# EAGLE design delay_line (EAGLE 9.2.2)
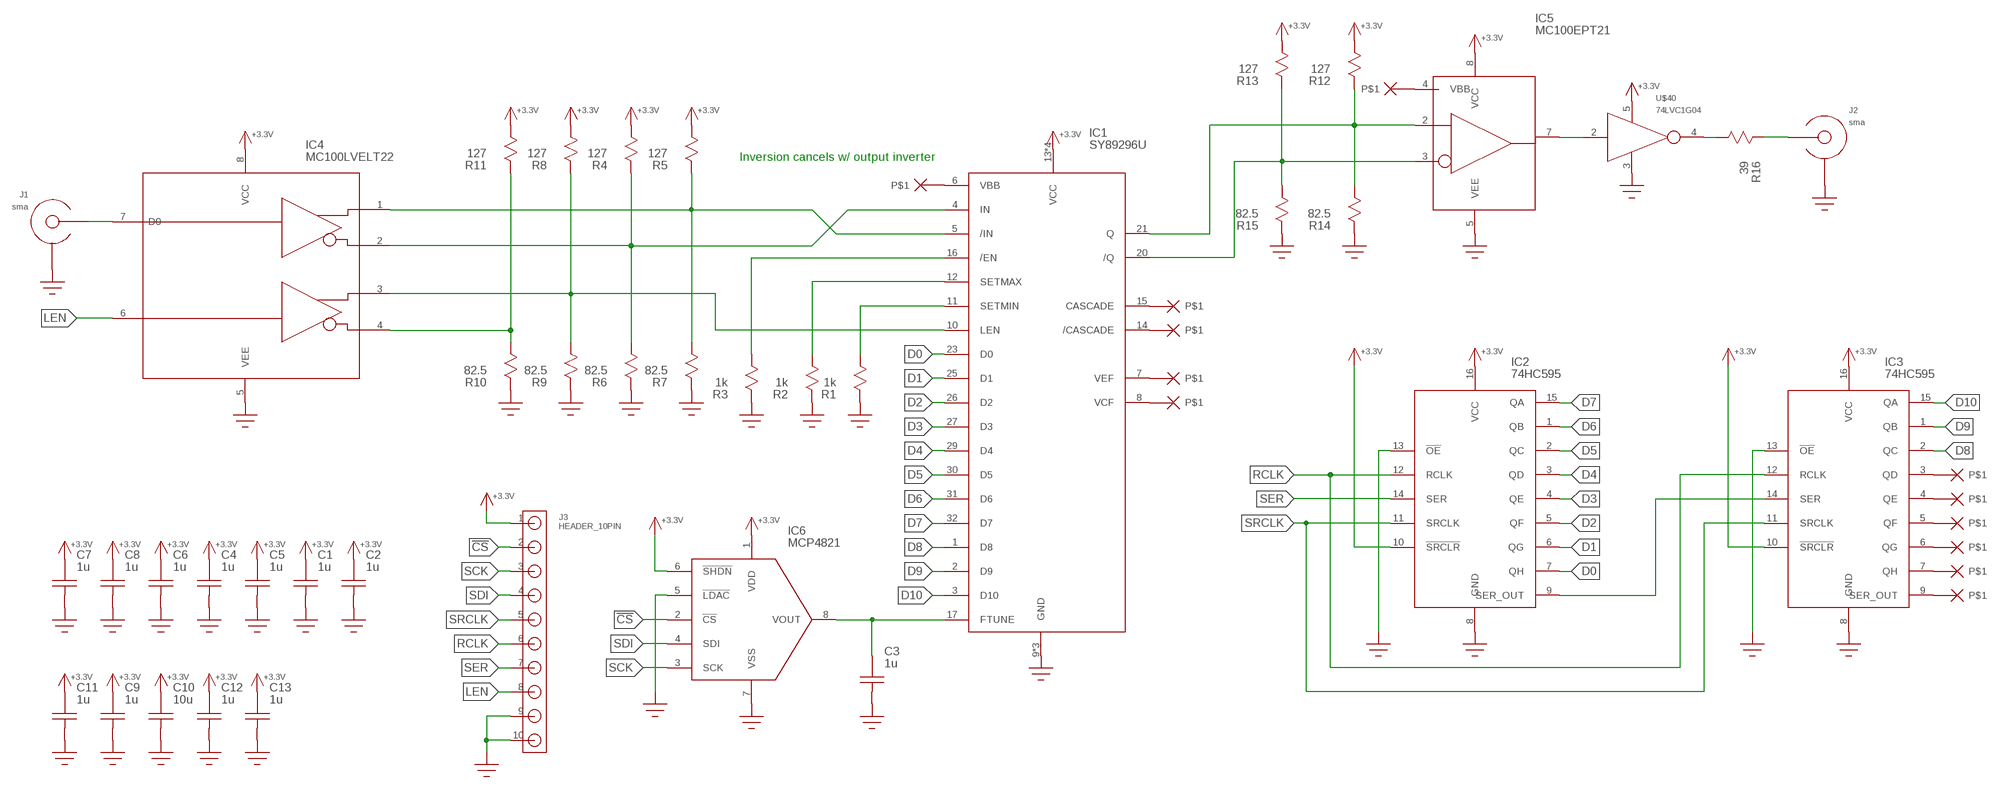
[diagram p0: schematic, sheet 1]

## Parts
C1  1u  C0603  [C0603]
C2  1u  C0603  [C0603]
C3  1u  C0603  [C0603]
C4  1u  C0603  [C0603]
C5  1u  C0603  [C0603]
C6  1u  C0603  [C0603]
C7  1u  C0603  [C0603]
C8  1u  C0603  [C0603]
C9  1u  C0805  [0805]
C10  10u  C1206  [1206]
C11  1u  C0805  [0805]
C12  1u  C0603  [C0603]
C13  1u  C0805  [0805]
IC1  SY89296U  [TQFP32_7X7]
IC2  74HC595  74XX595  [SOIC-16]
IC3  74HC595  74XX595  [SOIC-16]
IC4  MC100LVELT22  [SOIC8]
IC5  MC100EPT21  [SOIC8]
IC6  MCP4821  MCP48X1  [SOIC8]
J1  sma  EDGE_LAUNCH_JACK  [EDGE_LAUNCH_RF_CON]
J2  sma  EDGE_LAUNCH_JACK  [EDGE_LAUNCH_RF_CON]
J3  HEADER_10PIN  [HEADER_10PIN]
R1  1k  R0603  [R0603]
R2  1k  R0603  [R0603]
R3  1k  R0603  [R0603]
R4  127  R0603  [R0603]
R5  127  R0603  [R0603]
R6  82.5  R0603  [R0603]
R7  82.5  R0603  [R0603]
R8  127  R0603  [R0603]
R9  82.5  R0603  [R0603]
R10  82.5  R0603  [R0603]
R11  127  R0603  [R0603]
R12  127  R0603  [R0603]
R13  127  R0603  [R0603]
R14  82.5  R0603  [R0603]
R15  82.5  R0603  [R0603]
R16  39  R0603  [R0603]
U$15  NO_CONNECT  (no package)
U$16  NO_CONNECT  (no package)
U$17  NO_CONNECT  (no package)
U$18  NO_CONNECT  (no package)
U$19  NO_CONNECT  (no package)
U$20  NO_CONNECT  (no package)
U$21  NO_CONNECT  (no package)
U$22  NO_CONNECT  (no package)
U$23  NO_CONNECT  (no package)
U$24  NO_CONNECT  (no package)
U$25  NO_CONNECT  (no package)
U$40  74LVC1G04  [SOT23-5]
U$71  NO_CONNECT  (no package)

## Nets
!CS!: IC6.2(!CS!) J3.2
+3.3V: C1.P$2 C2.P$2 C4.P$2 C5.P$2 C6.P$2 C7.P$2 C8.P$2 C9.P$2 C10.P$2 C11.P$2 C12.P$2 C13.P$2 IC1.13(VCC) IC1.18(VCC) IC1.19(VCC) IC1.22(VCC) IC2.10(!SRCLR!) IC2.16(VCC) IC3.10(!SRCLR!) IC3.16(VCC) IC4.8(VCC) IC5.8(VCC) IC6.1(VDD) IC6.6(!SHDN!) J3.1 R4.P$2 R5.P$2 R8.P$2 R11.P$2 R12.P$2 R13.P$2 U$40.5(VCC)
D0: IC1.23(D0) IC2.7(QH)
D1: IC1.25(D1) IC2.6(QG)
D2: IC1.26(D2) IC2.5(QF)
D3: IC1.27(D3) IC2.4(QE)
D4: IC1.29(D4) IC2.3(QD)
D5: IC1.30(D5) IC2.2(QC)
D6: IC1.31(D6) IC2.1(QB)
D7: IC1.32(D7) IC2.15(QA)
D8: IC1.1(D8) IC3.2(QC)
D9: IC1.2(D9) IC3.1(QB)
D10: IC1.3(D10) IC3.15(QA)
GND: C1.P$1 C2.P$1 C3.P$1 C4.P$1 C5.P$1 C6.P$1 C7.P$1 C8.P$1 C9.P$1 C10.P$1 C11.P$1 C12.P$1 C13.P$1 IC1.9(GND) IC1.24(GND) IC1.28(GND) IC2.8(GND) IC2.13(!OE!) IC3.8(GND) IC3.13(!OE!) IC4.5(VEE) IC5.5(VEE) IC6.5(!LDAC!) IC6.7(VSS) J1.GND@1(SHIELD) J1.GND@2(SHIELD) J1.GND@3(SHIELD) J1.GND@4(SHIELD) J1.GND@5(SHIELD) J1.GND@6(SHIELD) J1.GND@7(SHIELD) J1.GND@8(SHIELD) J1.GND@9(SHIELD) J1.GND@10(SHIELD) J1.GND@11(SHIELD) J1.GND@12(SHIELD) J1.SHIELD@1(SHIELD) J1.SHIELD@2(SHIELD) J2.GND@1(SHIELD) J2.GND@2(SHIELD) J2.GND@3(SHIELD) J2.GND@4(SHIELD) J2.GND@5(SHIELD) J2.GND@6(SHIELD) J2.GND@7(SHIELD) J2.GND@8(SHIELD) J2.GND@9(SHIELD) J2.GND@10(SHIELD) J2.GND@11(SHIELD) J2.GND@12(SHIELD) J2.SHIELD@1(SHIELD) J2.SHIELD@2(SHIELD) J3.9 J3.10 R1.P$1 R2.P$1 R3.P$1 R6.P$1 R7.P$1 R9.P$1 R10.P$1 R14.P$1 R15.P$1 U$40.3(GND)
IN_N [50_ohm]: IC1.5(/IN) IC4.1(Q0) R5.P$1 R7.P$2
IN_P [50_ohm]: IC1.4(IN) IC4.2(!Q0!) R4.P$1 R6.P$2
LEN: IC4.6(D1) J3.8
N$1: IC2.9(SER_OUT) IC3.14(SER)
N$2: IC1.7(VEF) U$15.P$1
N$3: IC3.3(QD) U$16.P$1
N$4: IC3.4(QE) U$17.P$1
N$5: IC3.5(QF) U$18.P$1
N$6: IC3.6(QG) U$19.P$1
N$7: IC3.7(QH) U$20.P$1
N$8: IC3.9(SER_OUT) U$21.P$1
N$9: IC1.6(VBB) U$22.P$1
N$10: IC1.8(VCF) U$23.P$1
N$11: IC1.15(CASCADE) U$24.P$1
N$12: IC1.14(/CASCADE) U$25.P$1
N$13: IC1.11(SETMIN) R1.P$2
N$14: IC1.12(SETMAX) R2.P$2
N$15: IC1.16(/EN) R3.P$2
N$18: IC1.10(LEN) IC4.3(Q1) R8.P$1 R9.P$2
N$19: IC4.4(!Q1!) R10.P$2 R11.P$1
N$20: IC5.7(Q) U$40.2(IN)
N$21: IC4.7(D0) J1.CENTER
N$24: R16.P$2 U$40.4(OUT)
N$25: J2.CENTER R16.P$1
N$26: C3.P$2 IC1.17(FTUNE) IC6.8(VOUT)
N$37: IC5.4(VBB) U$71.P$1
Q_N [50_ohm]: IC1.20(/Q) IC5.3(!D!) R13.P$1 R15.P$2
Q_P [50_ohm]: IC1.21(Q) IC5.2(D) R12.P$1 R14.P$2
RCLK: IC2.12(RCLK) IC3.12(RCLK) J3.6
SCK: IC6.3(SCK) J3.3
SDI: IC6.4(SDI) J3.4
SER: IC2.14(SER) J3.7
SRCLK: IC2.11(SRCLK) IC3.11(SRCLK) J3.5

## Notes on the sheet
- Inversion cancels w/ output inverter

## Library data of the parts
C1-C13 = yapo:C
IC1 = yapo:SY89296U
IC2 IC3 = yapo:74XX595
IC4 = yapo:MC100LVELT22
IC5 = yapo:MC100EPT21
IC6 = yapo:MCP48X1
J1 J2 = yapo:EDGE_LAUNCH_JACK
J3 = yapo:HEADER_10PIN
R1-R16 = yapo:R
U$15-U$25 U$71 = yapo:NO_CONNECT
U$40 = yapo:74LVC1G04

## Net classes
1 50_ohm: width 0.345 mm, clearance 0.244 mm

## Board
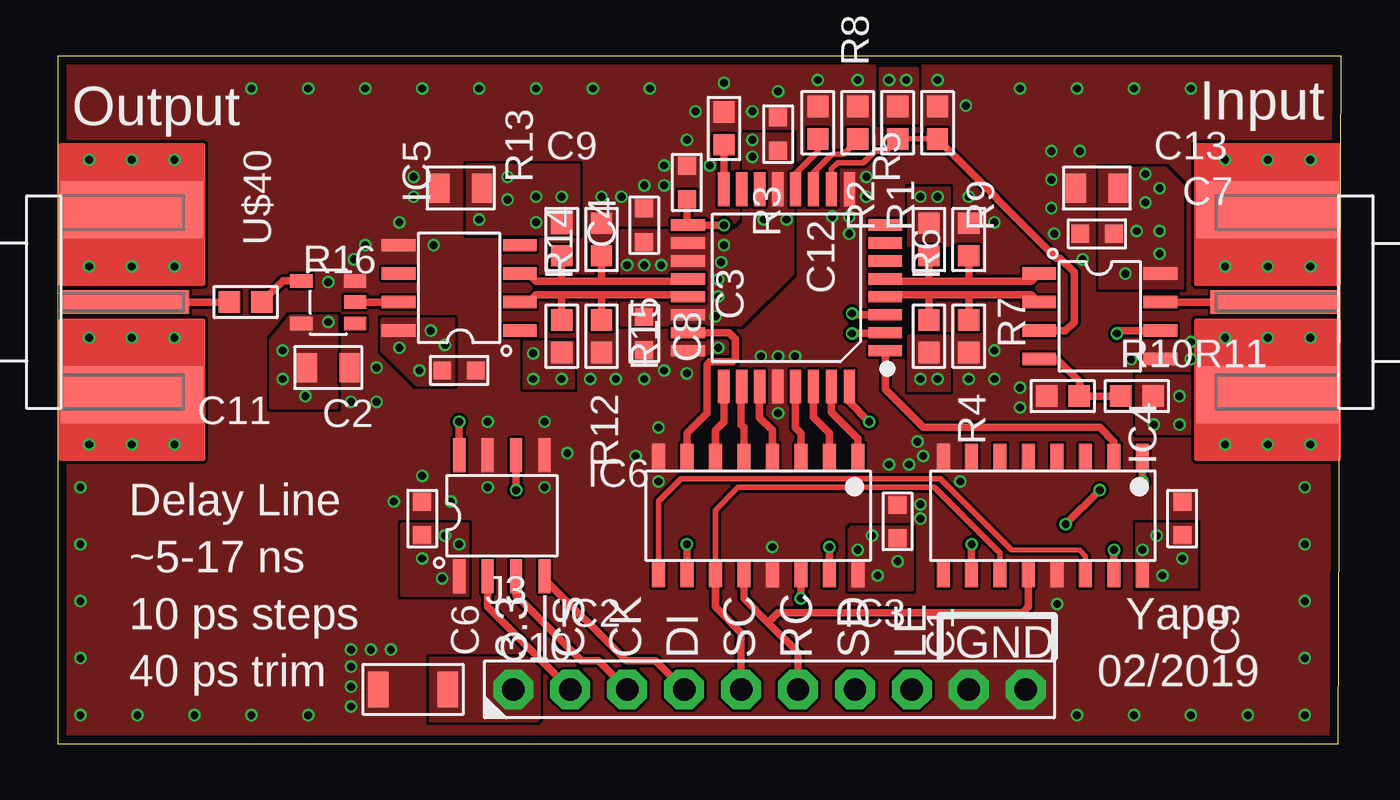
[diagram p1: board, top side]
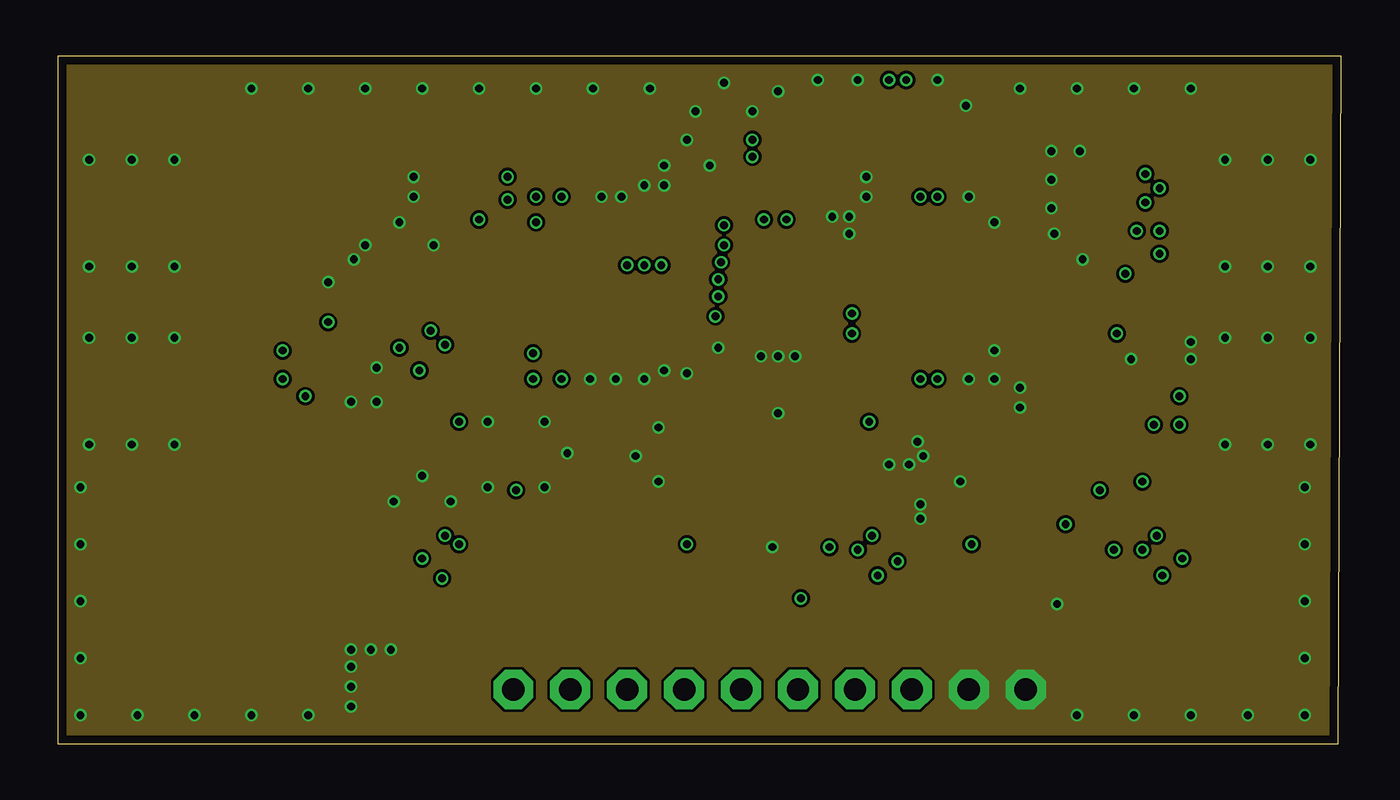
[diagram p2: board, inner layer Route2]
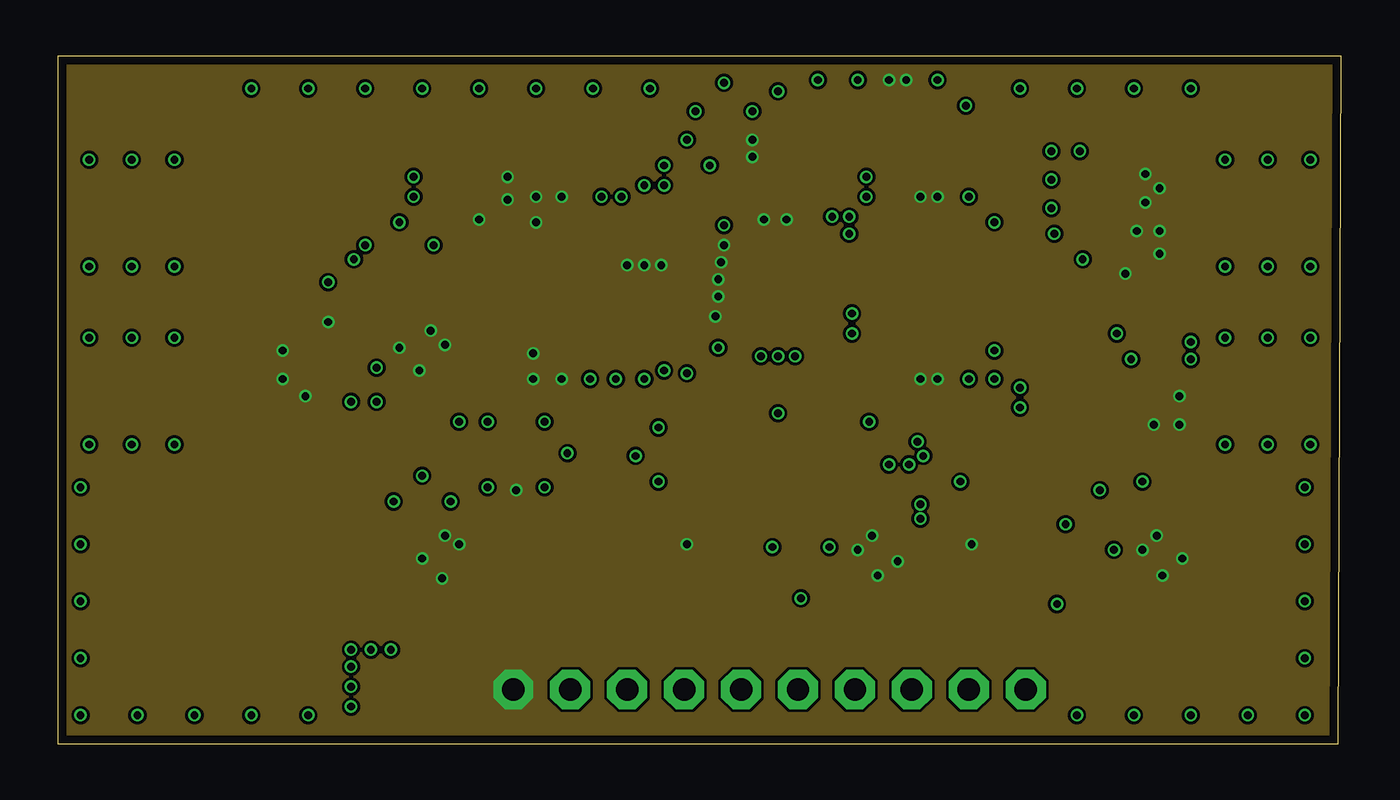
[diagram p3: board, inner layer Route15]
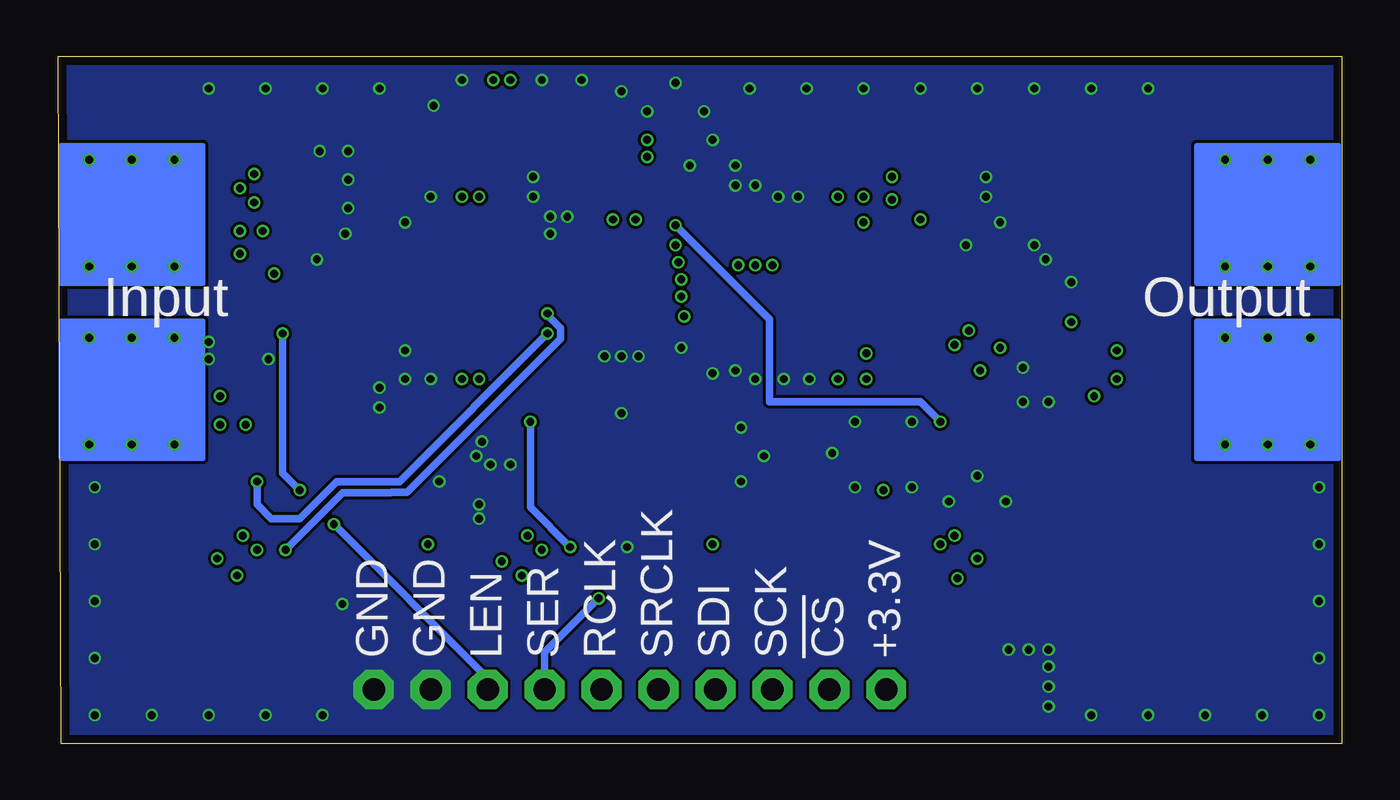
[diagram p4: board, bottom side, seen from below]

Size 57.26 x 30.66 mm. Coordinates in mm from the lower left corner, seen from the top.
Outline: 0,0 57.13,0 57.26,30.66 0,30.66 0,0
Copper layers (1*2*15*16): Top 0.035559375mm / dielectric 0.17018125mm / Route2 0.01778125mm / dielectric 47mil / Route15 0.01778125mm / dielectric 0.17018125mm / Bottom 0.035559375mm
Design rules "oshpark-4layer *": minimum track width 5mil, minimum drill 10mil, track to track 5mil, track to pad 5mil, pad to pad 5mil, via to via 5mil, smd to smd 5mil, copper to edge 15mil, drill to drill 6mil, minimum pad ring 4mil, minimum via ring 4mil, stop-mask expansion 2.5mil, vias tented up to drill 20mil, thermal gap 10mil

### Footprints (pad centres in the part's own frame; a part is rotated, then mirrored left to right if it is on the bottom)
C0603 = smd 0.8 x 0.8: P$1 -0.75,0; P$2 0.75,0
0805 = smd 0.9 x 1.3: P$1 -0.95,0; P$2 0.95,0
1206 = smd 0.9 x 1.6: P$1 -1.55,0; P$2 1.55,0
TQFP32_7X7 = smd 1.5 x 0.5: 1 -4.4,2.8; 2 -4.4,2; 3 -4.4,1.2; 4 -4.4,0.4; 5 -4.4,-0.4; 6 -4.4,-1.2; 7 -4.4,-2; 8 -4.4,-2.8; 17 4.4,-2.8; 18 4.4,-2; 19 4.4,-1.2; 20 4.4,-0.4; 21 4.4,0.4; 22 4.4,1.2; 23 4.4,2; 24 4.4,2.8 | smd 0.5 x 1.5: 9 -2.8,-4.4; 10 -2,-4.4; 11 -1.2,-4.4; 12 -0.4,-4.4; 13 0.4,-4.4; 14 1.2,-4.4; 15 2,-4.4; 16 2.8,-4.4; 25 2.8,4.4; 26 2,4.4; 27 1.2,4.4; 28 0.4,4.4; 29 -0.4,4.4; 30 -1.2,4.4; 31 -2,4.4; 32 -2.8,4.4
SOIC-16 = smd 0.58 x 1.12: 1 -4.445,-2.64; 2 -3.175,-2.64; 3 -1.905,-2.64; 4 -0.635,-2.64; 5 0.635,-2.64; 6 1.905,-2.64; 7 3.175,-2.64; 8 4.445,-2.64; 9 4.445,2.64; 10 3.175,2.64; 11 1.905,2.64; 12 0.635,2.64; 13 -0.635,2.64; 14 -1.905,2.64; 15 -3.175,2.64; 16 -4.445,2.64
SOIC8 = smd 0.55 x 1.5: 1 -1.905,-2.7; 2 -0.635,-2.7; 3 0.635,-2.7; 4 1.905,-2.7; 5 1.905,2.7; 6 0.635,2.7; 7 -0.635,2.7; 8 -1.905,2.7
EDGE_LAUNCH_RF_CON = smd 5.715 x 1.041: CENTER -2.875,0 | drill 0.35: GND@1 -5.08,1.587; GND@2 -3.175,1.587; GND@3 -1.27,1.587; GND@4 -5.08,-1.587; GND@5 -3.175,-1.587; GND@6 -1.27,-1.587; GND@7 -5.08,6.35; GND@8 -3.175,6.35; GND@9 -1.27,6.35; GND@10 -5.08,-6.35; GND@11 -3.175,-6.35; GND@12 -1.27,-6.35 | smd 6.35 x 2.54: SHIELD@1 -3.175,-4.128; SHIELD@2 -3.175,4.128
HEADER_10PIN = drill 1 pad 1.778 octagon: 1 -11.43,0; 2 -8.89,0; 3 -6.35,0; 4 -3.81,0; 5 -1.27,0; 6 1.27,0; 7 3.81,0; 8 6.35,0; 9 8.89,0; 10 11.43,0
R0603 = smd 0.95 x 0.95: P$1 -0.725,0; P$2 0.725,0
SOT23-5 = smd 0.6 x 1: 1 -0.95,-1.2; 2 0,-1.2; 3 0.95,-1.2; 4 0.95,1.2; 5 -0.95,1.2

### Placement (x,y rotation side)
C1  37.47,9.91 270 top
C2  17.91,16.64 180 top
C3  28.07,25.02 270 top
C4  26.16,18.29 90 top
C5  50.16,10.03 270 top
C6  16.26,10.03 270 top
C7  46.35,22.73 0 top
C8  26.16,23.11 270 top
C9  17.97,24.77 0 top
C10  15.85,2.41 0 top
C11  12.06,16.76 180 top
C12  32.13,27.18 270 top
C13  46.35,24.77 0 top
IC1  32.51,20.32 180 top
IC2  31.24,10.16 180 top
IC3  43.94,10.16 180 top
IC4  46.48,19.05 270 top
IC5  17.91,20.32 90 top
IC6  19.81,10.16 0 top
J1  57.15,19.68 0 top
J2  0.13,19.68 180 top
J3  31.75,2.41 0 top
R1  35.69,27.69 270 top
R2  33.91,27.69 270 top
R3  29.72,27.43 270 top
R4  38.86,18.16 270 top
R5  38.86,22.48 90 top
R6  40.64,18.16 90 top
R7  40.64,22.48 270 top
R8  37.47,27.69 90 top
R9  39.24,27.69 270 top
R10  44.83,15.49 0 top
R11  48.13,15.49 0 top
R12  22.48,18.16 270 top
R13  22.48,22.48 90 top
R14  24.26,18.16 90 top
R15  24.26,22.48 270 top
R16  8.38,19.68 0 top
U$40  12.06,19.68 90 top

### Tracks (layer width: path | path; a pad name or v marks a point on that pad's centre or on a via)
!CS!
  Top 0.345: J3.2 19.18,6.1 IC6.2
+3.3V  (via drill 0.35)
  Top 0.345: IC2.10 v28.07,8.89 | IC3.10 v40.77,8.89 | IC6.6 v20.45,11.3
  other vias: 25.4,21.34 26.16,21.34 26.92,21.34 29.34,19.05 29.46,19.94 31.5,23.37 32.51,23.37 35.69,8.64 37.47,8.13 36.58,7.49 36.32,9.27 49.02,9.27 48.39,8.64 50.16,8.26 49.28,7.49 17.91,8.89 17.27,9.27 16.26,8.26 17.14,7.37 16.64,18.41 16.13,16.64 15.24,17.65 17.27,17.78 12.06,18.8 11.05,15.49 10.03,16.26 10.03,17.53 22.48,16.26 21.21,17.4 21.21,16.26 22.48,24.38 21.34,24.38 21.34,23.24 30.99,26.92 30.99,26.16 37.08,29.59 37.85,29.59 49.15,21.84 47.62,20.95 48.13,22.86 49.15,22.86 50.04,15.49 48.9,14.22 50.04,14.22 38.48,24.38 39.24,24.38 38.48,16.26 39.24,16.26 29.59,21.46 29.72,22.23 29.46,20.7 20.07,25.27 20.07,24.26 18.8,23.37 48.51,24.13 48.51,25.4 49.15,24.77
  pour Top (no thermals): 35.31,9.53 35.31,6.86 38.1,6.86 38.1,9.53 37.97,9.65 35.43,9.65
  pour Top (no thermals): 48.13,6.99 48.13,9.78 50.8,9.78 50.8,6.99
  pour Top (no thermals): 15.37,9.78 18.29,9.78 18.29,6.6 15.37,6.6
  pour Top (no thermals): 14.48,18.92 14.48,17.53 16,16 17.65,16 17.65,18.92
  pour Top (no thermals): 10.36,19.05 12.45,19.05 12.45,14.99 9.53,14.99 9.53,18
  pour Route15 (no thermals): 0,0 0,30.61 57.15,30.61 57.15,0
  pour Top (no thermals): 22.86,17.91 20.83,17.91 20.83,15.88 20.95,15.88 22.99,15.88 22.99,17.91
  pour Top (no thermals): 18.29,22.73 23.24,22.73 23.24,25.78 18.29,25.78
  pour Top (no thermals): 36.7,27.69 36.7,30.1 38.35,30.1 38.35,27.69
  pour Top (no thermals): 46.48,20.32 46.48,25.65 49.4,25.65 50.16,24.89 50.16,20.32
  pour Top (no thermals): 48.13,16.38 48.13,13.84 50.67,13.84 50.67,16.26 50.55,16.38 48.26,16.38
  pour Top (no thermals): 37.97,24.77 37.97,22.23 39.75,22.23 39.75,24.77
  pour Top (no thermals): 37.97,18.16 39.75,18.16 39.75,15.75 37.97,15.75
  pour Top (no thermals): 25.15,18.67 30.48,18.67 32.77,20.95 32.77,27.18 30.61,27.18 30.61,23.24 30.23,22.86 25.15,22.86
  pour Top (no thermals): 16.64,3.81 21.34,3.81 21.46,3.68 21.46,1.14 21.34,1.02 16.64,1.02
D0
  Top 0.345: IC1.23 29.94,18.32 30.23,18.03 30.23,17.14 30.1,17.02 29.08,17.02 28.96,16.89 28.96,14.73 28.07,13.84 IC2.7
D1
  Top 0.345: IC2.6 29.34,13.97 29.72,14.35 IC1.25
D2
  Top 0.345: IC2.5 30.61,14.1 30.48,14.22 30.48,15.89 IC1.26
D3
  Top 0.345: IC2.4 31.88,13.97 31.31,14.54 IC1.27
D4
  Top 0.345: IC2.3 33.15,13.84 32.91,14.08 IC1.29
D5
  Top 0.345: IC2.2 34.42,13.84 33.71,14.55 IC1.30
D6
  Top 0.345: IC2.1 35.69,13.59 34.51,14.76 IC1.31
D7  (via drill 0.35)
  Top 0.345: IC1.32 35.31,15.23 v36.2,14.35 | v34.42,8.76 IC2.15
  Bottom 0.345: v36.2,14.35 36.2,10.54 v34.42,8.76
D8
  Top 0.345: IC1.1 36.91,15.79 38.61,14.1 46.48,14.1 47.12,13.46 IC3.2
D9  (via drill 0.35)
  Top 0.345: IC1.2 36.88,18.29 v35.43,18.29 | v48.39,11.68 IC3.1
  Bottom 0.345: v35.43,18.29 42.04,11.68 44.83,11.68 46.48,10.03 47.75,10.03 48.39,10.67 v48.39,11.68
D10  (via drill 0.35)
  Top 0.345: IC1.3 35.49,19.12 v35.43,19.18 | IC3.15 v47.12,8.64
  Bottom 0.345: v35.43,19.18 35.43,19.1 34.86,18.53 34.86,18.05 41.69,11.21 42.38,11.21 42.42,11.18 44.58,11.18 v47.12,8.64
GND  (via drill 0.35)
  other vias: 12.06,20.57 16.76,22.23 15.24,23.24 13.72,22.23 13.08,15.24 14.22,16.76 14.22,15.24 13.21,21.59 23.75,16.26 24.89,16.26 26.16,16.26 27.05,16.64 29.46,17.65 28.07,16.51 19.18,14.35 21.72,14.35 19.18,11.43 21.72,11.43 22.73,12.95 16.26,11.94 17.53,10.79 14.99,10.79 25.78,12.83 26.8,14.1 26.8,11.68 31.88,8.76 38.48,10.67 38.48,10.03 37.97,12.45 37.08,12.45 44.58,6.22 38.61,12.83 40.26,11.68 38.35,13.46 42.93,14.99 42.93,15.88 40.64,16.26 41.78,17.53 41.78,16.26 41.78,23.24 40.64,24.38 44.32,23.88 44.45,22.73 45.72,21.59 47.88,17.14 50.55,17.14 50.55,17.91 39.24,29.59 40.51,28.45 35.69,29.59 33.91,29.59 32.13,29.08 29.72,29.46 30.99,28.19 28.45,28.19 28.07,26.92 29.08,25.78 27.05,25.78 26.16,24.89 24.26,24.38 25.15,24.38 27.05,24.89 32.13,14.73 31.37,17.27 35.31,23.5 36.07,25.27 36.07,24.38 34.54,23.5 32.89,17.27 35.31,22.73 32.13,17.27 15.88,25.27 15.88,24.38 1.02,1.27 1.02,3.81 1.02,6.35 1.02,8.89 1.02,11.43 3.56,1.27 6.1,1.27 8.64,1.27 55.63,1.27 11.18,1.27 48.01,1.27 53.09,1.27 50.55,1.27 55.63,3.81 55.63,6.35 55.63,8.89 55.63,11.43 8.64,29.21 11.18,29.21 13.72,29.21 16.26,29.21 18.8,29.21 21.34,29.21 23.88,29.21 26.42,29.21 50.55,29.21 48.01,29.21 45.47,29.21 42.93,29.21 45.47,1.27 13.08,3.43 13.08,2.54 13.08,1.65 13.08,4.19 13.97,4.19 14.86,4.19 44.32,25.15 44.32,26.42 45.59,26.42
  pour Top (rank 2, no thermals): 0,0 0,30.61 57.15,30.61 57.15,0
  pour Route2 (no thermals): 0,30.61 57.15,30.61 57.15,0 0,0
  pour Bottom (no thermals): 0,30.61 0,0 57.15,0 57.15,30.61
IN_N
  Top 0.345: IC4.1 43.43,20.61 40.64,20.61 | IC1.5 37.02,20.61 40.64,20.61 | 39.11,20.61 38.86,20.61 R5.P$1 | 39.11,20.61 | R7.P$2 40.64,20.61 | 39.11,20.61 40.64,20.61
IN_P
  Top 0.345: IC4.2 43.43,20.02 40.64,20.02 | 40.64,20.02 38.86,20.02 | 38.86,20.02 37.04,20.02 36.96,19.94 36.93,19.94 IC1.4 | R4.P$1 38.86,20.02 | R6.P$2 40.64,20.02
LEN  (via drill 0.35)
  Top 0.345: v47.24,18.29 47.37,18.41 IC4.6 | v44.96,9.78 v46.48,11.3
  Bottom 0.345: J3.8 38.1,2.67 38.23,2.79 38.23,3.05 v44.96,9.78 | v46.48,11.3 47.24,12.06 v47.24,18.29
N$1
  Top 0.254: IC3.14 45.85,8.36 45.59,8.62 42.53,8.65 39.37,11.81 27.81,11.81 26.8,10.79 IC2.9
N$13
  Top 0.254: IC1.11 33.71,25.46 34.49,26.23 34.55,26.29 35.05,26.29 35.69,26.92 R1.P$2
N$14
  Top 0.254: IC1.12 32.91,25.42 33.91,26.42 R2.P$2
N$15
  Top 0.345: IC1.16 R3.P$2
N$18
  Top 0.254: IC1.10 34.51,25.62 34.8,25.91 35.94,25.91 36.45,26.42 36.96,26.42 37.47,26.92 R8.P$1 R9.P$2
  Top 0.345: IC4.3 44.96,18.41 45.34,18.8 45.34,21.01 44.7,21.65 44.56,21.65 R9.P$2
N$19
  Top 0.345: R10.P$2 45.72,15.49 | 45.72,15.49 R11.P$1 | IC4.4 44.58,17.14 45.59,16.13 45.59,15.62 45.72,15.49
N$20
  Top 0.345: IC5.7 U$40.2
N$21
  Top 0.345: J1.CENTER IC4.7
N$24
  Top 0.345: R16.P$2 10.06,20.64 U$40.4
N$25
  Top 0.345: J2.CENTER R16.P$1
N$26  (via drill 0.35)
  Top 0.345: C3.P$2 28.07,23.16 IC1.17 v29.72,23.11 | IC6.8 v17.91,14.35
  Bottom 0.345: v17.91,14.35 18.8,15.24 25.53,15.24 25.53,18.92 v29.72,23.11
Q_N
  Top 0.345: IC5.3 21,20.95 21.34,20.61 22.48,20.61 | 22.48,20.61 24.26,20.61 | 24.26,20.61 28.01,20.61 IC1.20 | R13.P$1 22.48,20.61 | R15.P$2 24.26,20.61
Q_P
  Top 0.345: IC5.2 21,19.68 21.34,20.02 22.48,20.02 | 22.48,20.02 24.26,20.02 | 24.26,20.02 28.01,20.02 IC1.21 | R12.P$1 22.48,20.02 | R14.P$2 24.26,20.02
RCLK
  Top 0.345: IC2.12 30.61,6.48 31.69,5.4 | 31.69,5.4 33.02,4.06 J3.6 | IC3.12 43.31,6.1 43.05,5.84 32.13,5.84 31.69,5.4
SCK
  Top 0.345: J3.3 24.13,3.68 23.37,3.68 20.45,6.6 IC6.3
SDI
  Top 0.345: IC6.4 21.72,7.33 25.37,3.68 26.67,3.68 J3.4
SER  (via drill 0.35)
  Top 0.345: IC2.14 v33.15,6.48
  Bottom 0.345: v33.15,6.48 35.56,4.06 J3.7
SRCLK
  Top 0.254: IC2.11 29.34,10.41 30.35,11.43 39.12,11.43 42.04,8.51 IC3.11
  Top 0.345: J3.5 30.48,4.95 29.34,6.1 IC2.11

### Text on the board
tPlace: Output | Input | Delay Line | ~5-17 ns | 10 ps steps | Yapo | 3.3 | !CS! | CK | DI | SC | RC | SD | LE | GND | 40 ps trim | 02/2019
bPlace: Output | Input | +3.3V | !CS! | SCK | SDI | SRCLK | RCLK | SER | LEN | GND | GND